# Altium schematic sheet rocket_main_micro.SchDoc
size B
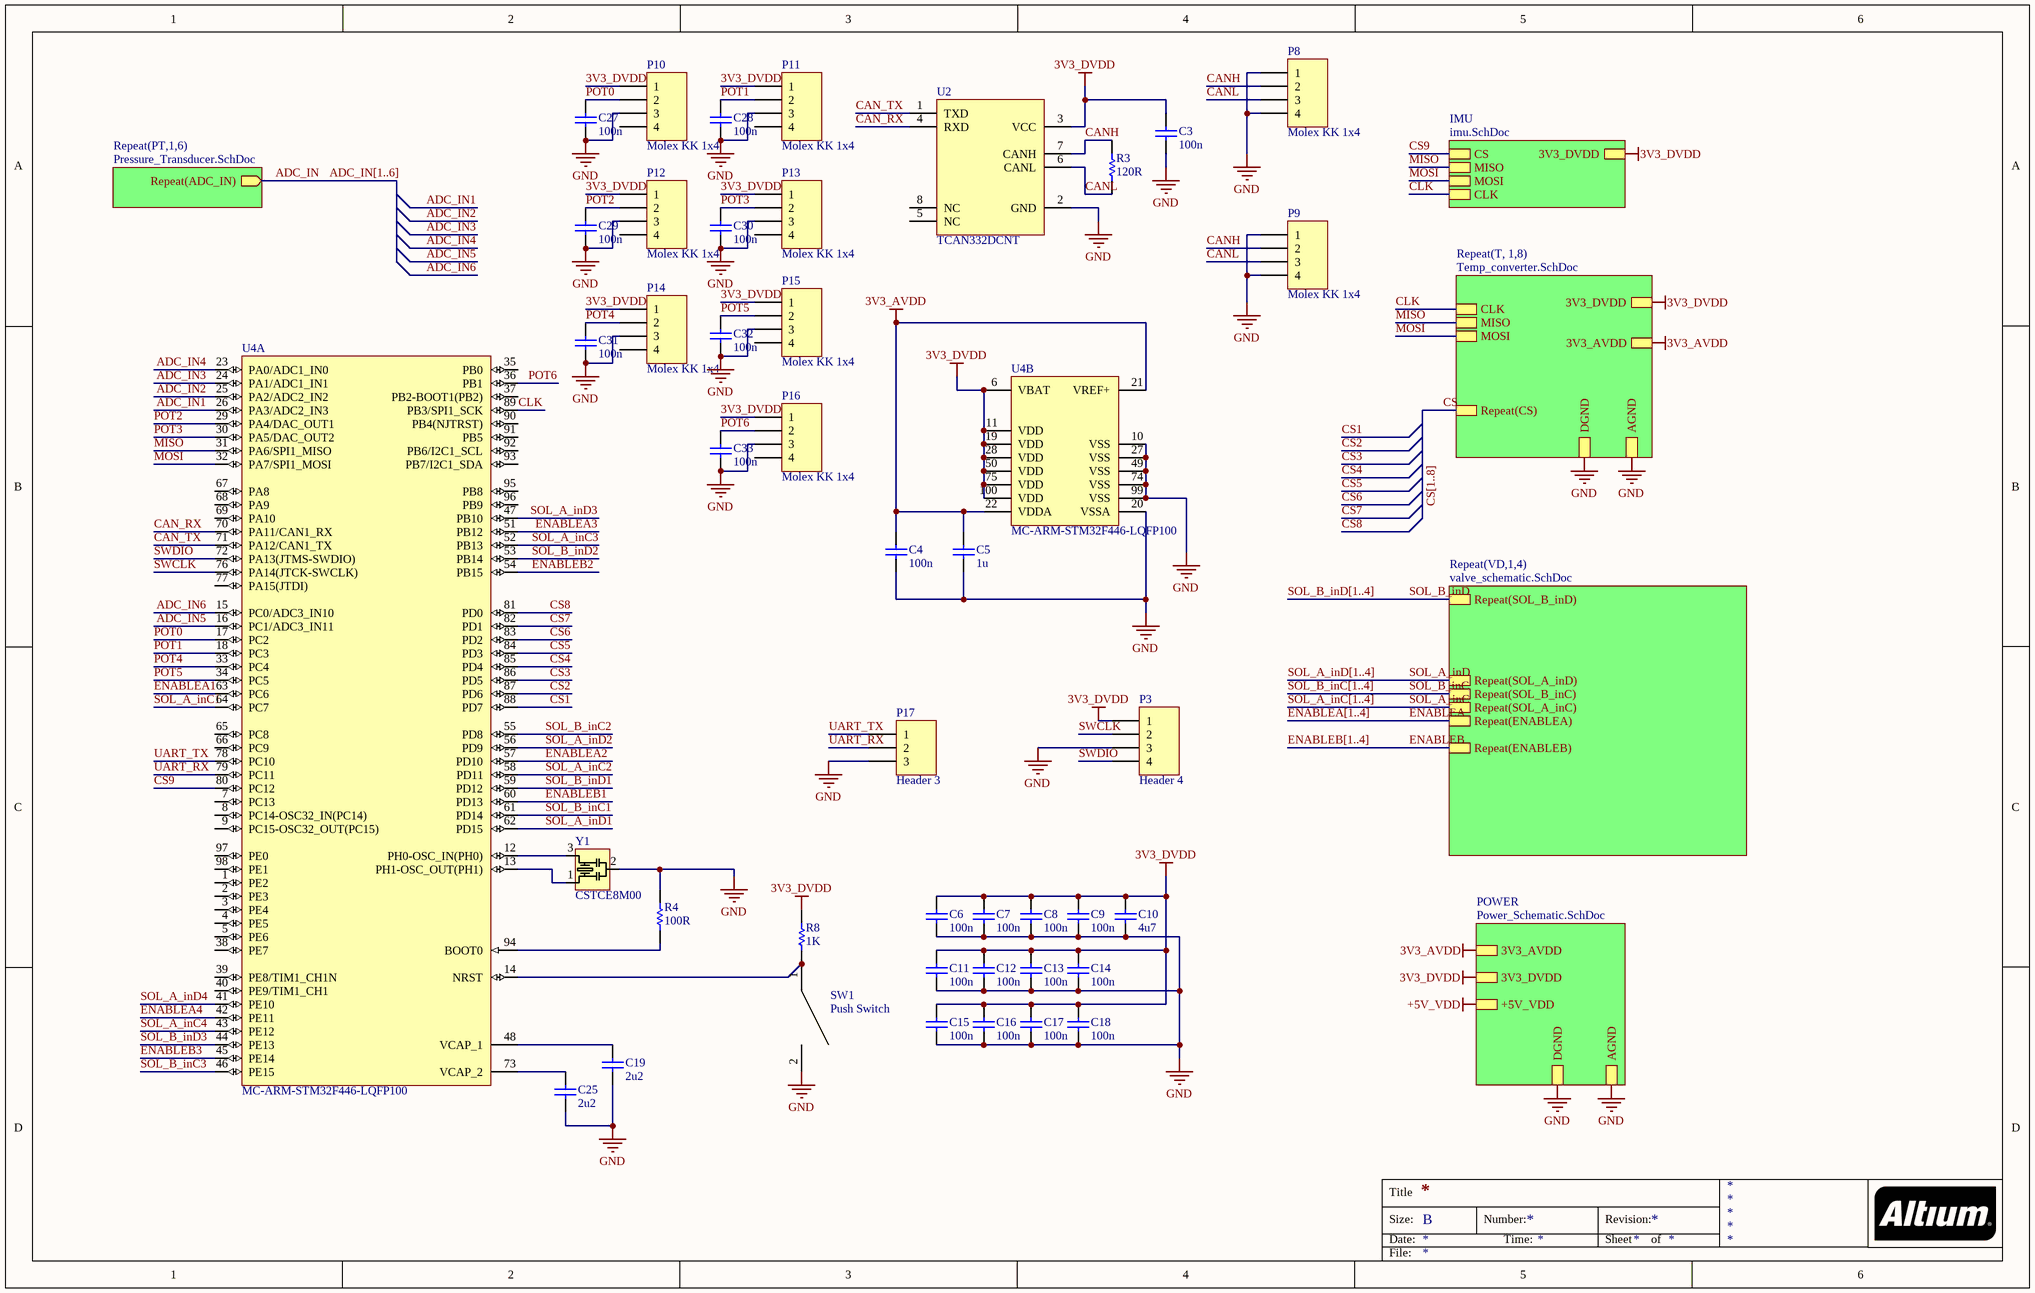
[diagram p0: rocket_main_micro.SchDoc]

## Parts
C3  100n  [C0805]
C4  100n  [C0805]
C5  1u  [C0805]
C6  100n  [C0805]
C7  100n  [C0805]
C8  100n  [C0805]
C9  100n  [C0805]
C10  4u7  [C0805]
C11  100n  [C0805]
C12  100n  [C0805]
C13  100n  [C0805]
C14  100n  [C0805]
C15  100n  [C0805]
C16  100n  [C0805]
C17  100n  [C0805]
C18  100n  [C0805]
C19  2u2  [C0805]
C25  2u2  [C0805]
C27  100n  [C0805]
C28  100n  [C0805]
C29  100n  [C0805]
C30  100n  [C0805]
C31  100n  [C0805]
C32  100n  [C0805]
C33  100n  [C0805]
P3  Header 4  [HDR1X4]
P8  Molex KK 1x4  [Molex KK 4x1]
P9  Molex KK 1x4  [Molex KK 4x1]
P10  Molex KK 1x4  [Molex KK 4x1]
P11  Molex KK 1x4  [Molex KK 4x1]
P12  Molex KK 1x4  [Molex KK 4x1]
P13  Molex KK 1x4  [Molex KK 4x1]
P14  Molex KK 1x4  [Molex KK 4x1]
P15  Molex KK 1x4  [Molex KK 4x1]
P16  Molex KK 1x4  [Molex KK 4x1]
P17  Header 3  [HDR1X3]
R3  120R  [R0805]
R4  100R  [R0805]
R8  1K  [R0805]
SW1  Push Switch  [PUSHBUTTON]
U2  TCAN332DCNT  [SOT-23-8]
U4  MC-ARM-STM32F446-LQFP100  [STM-LQFP100_N]  (parts A,B of 2)
Y1  CSTCE8M00  [8MHz Ceramic Resonator]

## Sub-sheets
IMU = imu.SchDoc: CS, 3V3_DVDD, MISO, MOSI, CLK
POWER = Power_Schematic.SchDoc: 3V3_DVDD, 3V3_AVDD, DGND, AGND, +5V_VDD
Repeat(PT,1,6) = Pressure_Transducer.SchDoc: Repeat(ADC_IN) (out)
Repeat(T, 1,8) = Temp_converter.SchDoc: AGND, MOSI, DGND, Repeat(CS), 3V3_DVDD, MISO, 3V3_AVDD, CLK
Repeat(VD,1,4) = valve_schematic.SchDoc: Repeat(SOL_B_inD), Repeat(SOL_A_inD), Repeat(SOL_B_inC), Repeat(SOL_A_inC), Repeat(ENABLEA), Repeat(ENABLEB)

## Nets
3V3_AVDD: C4.1 C5.1 U4.21(VREF+) U4.22(VDDA) ; sheet Repeat(T, 1,8)/3V3_AVDD, sheet POWER/3V3_AVDD
3V3_DVDD: C3.1 C6.1 C7.1 C8.1 C9.1 C10.1 C11.1 C12.1 C13.1 C14.1 C15.1 C16.1 C17.1 C18.1 P3.1 P10.1 P11.1 P12.1 P13.1 P14.1 P15.1 P16.1 R8.2 U2.3(VCC) U4.6(VBAT) U4.11(VDD) U4.19(VDD) U4.28(VDD) U4.50(VDD) U4.75(VDD) U4.100(VDD) ; sheet Repeat(T, 1,8)/3V3_DVDD, sheet POWER/3V3_DVDD, sheet IMU/3V3_DVDD
+5V_VDD: sheet POWER/+5V_VDD
GND: C3.2 C4.2 C5.2 C6.2 C7.2 C8.2 C9.2 C10.2 C11.2 C12.2 C13.2 C14.2 C15.2 C16.2 C17.2 C18.2 C19.2 C25.2 C27.2 C28.2 C29.2 C30.2 C31.2 C32.2 C33.2 P3.3 P8.1 P8.4 P9.1 P9.4 P10.3 P11.3 P12.3 P13.3 P14.3 P15.3 P16.3 P17.3 R4.2 SW1.2 U2.2(GND) U4.10(VSS) U4.20(VSSA) U4.27(VSS) U4.49(VSS) U4.74(VSS) U4.99(VSS) Y1.2(GND) ; sheet Repeat(T, 1,8)/AGND, sheet Repeat(T, 1,8)/DGND, sheet POWER/DGND, sheet POWER/AGND
ADC_IN: sheet Repeat(PT,1,6)/Repeat(ADC_IN)
ADC_IN1: U4.26(PA3/ADC2_IN3)
ADC_IN2: U4.25(PA2/ADC2_IN2)
ADC_IN3: U4.24(PA1/ADC1_IN1)
ADC_IN4: U4.23(PA0/ADC1_IN0)
ADC_IN5: U4.16(PC1/ADC3_IN11)
ADC_IN6: U4.15(PC0/ADC3_IN10)
CAN_RX: U2.4(RXD) U4.70(PA11/CAN1_RX)
CAN_TX: U2.1(TXD) U4.71(PA12/CAN1_TX)
CANH: P8.2 P9.2 R3.2 U2.7(CANH)
CANL: P8.3 P9.3 R3.1 U2.6(CANL)
CLK: U4.89(PB3/SPI1_SCK) ; sheet Repeat(T, 1,8)/CLK, sheet IMU/CLK
CS: sheet Repeat(T, 1,8)/Repeat(CS)
CS1: U4.88(PD7)
CS2: U4.87(PD6)
CS3: U4.86(PD5)
CS4: U4.85(PD4)
CS5: U4.84(PD3)
CS6: U4.83(PD2)
CS7: U4.82(PD1)
CS8: U4.81(PD0)
CS9: U4.80(PC12) ; sheet IMU/CS
ENABLEA: sheet Repeat(VD,1,4)/Repeat(ENABLEA)
ENABLEA1: U4.63(PC6)
ENABLEA2: U4.57(PD10)
ENABLEA3: U4.51(PB12)
ENABLEA4: U4.42(PE11)
ENABLEB: sheet Repeat(VD,1,4)/Repeat(ENABLEB)
ENABLEB1: U4.60(PD13)
ENABLEB2: U4.54(PB15)
ENABLEB3: U4.45(PE14)
MISO: U4.31(PA6/SPI1_MISO) ; sheet Repeat(T, 1,8)/MISO, sheet IMU/MISO
MOSI: U4.32(PA7/SPI1_MOSI) ; sheet Repeat(T, 1,8)/MOSI, sheet IMU/MOSI
POT0: C27.1 P10.2 U4.17(PC2)
POT1: C28.1 P11.2 U4.18(PC3)
POT2: C29.1 P12.2 U4.29(PA4/DAC_OUT1)
POT3: C30.1 P13.2 U4.30(PA5/DAC_OUT2)
POT4: C31.1 P14.2 U4.33(PC4)
POT5: C32.1 P15.2 U4.34(PC5)
POT6: C33.1 P16.2 U4.36(PB1)
SOL_A_inC: sheet Repeat(VD,1,4)/Repeat(SOL_A_inC)
SOL_A_inC1: U4.64(PC7)
SOL_A_inC2: U4.58(PD11)
SOL_A_inC3: U4.52(PB13)
SOL_A_inC4: U4.43(PE12)
SOL_A_inD: sheet Repeat(VD,1,4)/Repeat(SOL_A_inD)
SOL_A_inD1: U4.62(PD15)
SOL_A_inD2: U4.56(PD9)
SOL_A_inD3: U4.47(PB10)
SOL_A_inD4: U4.41(PE10)
SOL_B_inC: sheet Repeat(VD,1,4)/Repeat(SOL_B_inC)
SOL_B_inC1: U4.61(PD14)
SOL_B_inC2: U4.55(PD8)
SOL_B_inC3: U4.46(PE15)
SOL_B_inD: sheet Repeat(VD,1,4)/Repeat(SOL_B_inD)
SOL_B_inD1: U4.59(PD12)
SOL_B_inD2: U4.53(PB14)
SOL_B_inD3: U4.44(PE13)
SWCLK: P3.2 U4.76(PA14(JTCK-SWCLK))
SWDIO: P3.4 U4.72(PA13(JTMS-SWDIO))
UART_RX: P17.2 U4.79(PC11)
UART_TX: P17.1 U4.78(PC10)
NetC19_1: C19.1 U4.48(VCAP_1)
NetC25_1: C25.1 U4.73(VCAP_2)
NetR4_1: R4.1 U4.94(BOOT0)
NetR8_1: R8.1 SW1.1 U4.14(NRST)
NetU4_12: U4.12(PH0-OSC_IN(PH0)) Y1.3(OSC2)
NetU4_13: U4.13(PH1-OSC_OUT(PH1)) Y1.1(OSC1)

Not connected (* = marked no-connect by the designer): P10 4; P11 4; P12 4; P13 4; P14 4; P15 4; P16 4; U2 5(NC) 8(NC); U4 1(PE2) 2(PE3) 3(PE4) 4(PE5) 5(PE6) 7(PC13) 8(PC14-OSC32_IN(PC14)) 9(PC15-OSC32_OUT(PC15)) 35(PB0) 37(PB2-BOOT1(PB2)) 38(PE7) 39(PE8/TIM1_CH1N) 40(PE9/TIM1_CH1) 65(PC8) 66(PC9) 67(PA8) 68(PA9) 69(PA10) 77(PA15(JTDI)) 90(PB4(NJTRST)) 91(PB5) 92(PB6/I2C1_SCL) 93(PB7/I2C1_SDA) 95(PB8) 96(PB9) 97(PE0) 98(PE1)

## Buses and harness runs
bus ADC_IN[1..6]
bus CS[1..8]
bus ENABLEA[1..4]
bus ENABLEB[1..4]
bus SOL_A_inC[1..4]
bus SOL_A_inD[1..4]
bus SOL_B_inC[1..4]
bus SOL_B_inD[1..4]

## Notes on the sheet
- Title
- Size:
- Date:
- B
- Number:
- Time:
- Revision:
- Sheet
- of
- File:

## Library data of the parts
C3-C19 C25 C27-C33 = C0805: 0805 Capacitor
  C3 C4 C6-C9 C11-C18 C27-C33: Value: 100n
  C5: Value: 1u
  C10: Value: 4u7
  C19 C25: Value: 2u2
P3 = Header 4: Header, 4-Pin; LatestRevisionDate: 17-Jul-2002; LatestRevisionNote: Re-released for DXP Platform.; Publisher: Altium Limited
P8-P16 = Molex KK 1x4: 1x4 Molex KK Connector
P17 = Header 3: Header, 3-Pin; LatestRevisionDate: 17-Jul-2002; LatestRevisionNote: Re-released for DXP Platform.; Publisher: Altium Limited
R3 R4 R8 = R0805: RESISTOR 0805
  R3: Value: 120R
  R4: Value: 100R
  R8: Value: 1K
SW1 = PUSHBUTTON
U2 = TCAN332DCNT: IC TXRX CAN 3.3V SOT23-8
Y1 = CSTCE8M00: 8MHz Ceramic Resonator